# EAGLE design mftPlanetarium2-selfassemble (EAGLE 7.5.0)
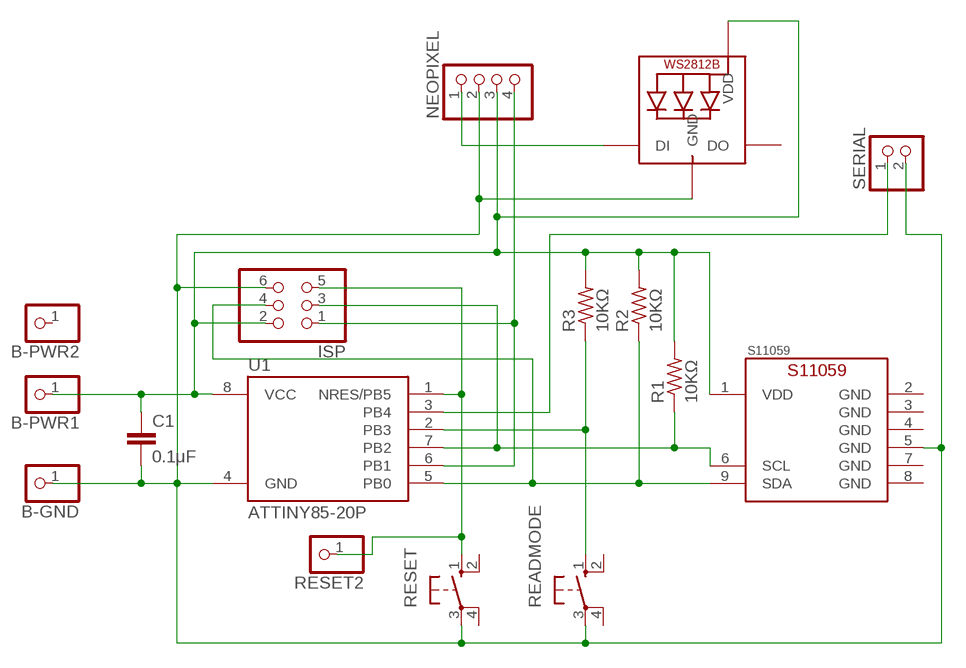
[diagram p0: schematic, sheet 1]

## Parts
B-GND  PINHD-1X1  [1X01]
B-PWR1  PINHD-1X1  [1X01]
B-PWR2  PINHD-1X1  [1X01]
C1  0.1μF  C-EU025-025X050  [C025-025X050]
ISP  PINHD-2X3  [2X03]
LED1  WS2812B5050  [WS2812B]
NEOPIXEL  PINHD-1X4  [1X04]
R1  10KΩ  R-US_0204/7  [0204/7]
R2  10KΩ  R-US_0204/7  [0204/7]
R3  10KΩ  R-US_0204/7  [0204/7]
READMODE  10-XX  [B3F-10XX]
RESET  10-XX  [B3F-10XX]
RESET2  PINHD-1X1  [1X01]
S11059  S11059  HAMAMATSU-S11059  [HAMAMATSU-S11059]
SERIAL  PINHD-1X2  [1X02]
U1  ATTINY85-20P  [PDIP08_300MIL]

## Nets
GND [Power]: B-GND.1 C1.2 ISP.6 LED1.3-GND(GND) NEOPIXEL.2 READMODE.3(P) RESET.3(P) S11059.5(GND) SERIAL.2 U1.4(GND)
N$1: LED1.4-DIN(DI) NEOPIXEL.1
N$3: ISP.1 NEOPIXEL.4 U1.6(PB1)
N$6: SERIAL.1 U1.3(PB4)
N$7 [Power]: ISP.5 RESET2.1 RESET.1(S) U1.1(NRES/PB5)
N$8: R3.1 READMODE.1(S) U1.2(PB3)
PWR [Power]: B-PWR1.1 C1.1 ISP.2 LED1.1-VDD(VDD) NEOPIXEL.3 R1.2 R2.2 R3.2 S11059.1(VDD) U1.8(VCC)
SCL: ISP.3 R1.1 S11059.6(SCL) U1.7(PB2)
SDA: ISP.4 R2.1 S11059.9(SDA) U1.5(PB0)
Unconnected: B-PWR2.1 LED1.2-DOUT(DO) READMODE.2(S1) READMODE.4(P1) RESET.2(S1) RESET.4(P1) S11059.2(GND) S11059.3(GND) S11059.4(GND) S11059.7(GND) S11059.8(GND)

## Library data of the parts
B-GND B-PWR1 B-PWR2 RESET2 = pinhead:PINHD-1X1: PIN HEADER
C1 = resistor:C-EU: CAPACITOR, European symbol
ISP = pinhead:PINHD-2X3: PIN HEADER
LED1 = adafruit:WS2812B
NEOPIXEL = pinhead:PINHD-1X4: PIN HEADER
R1-R3 = resistor:R-US_: RESISTOR, American symbol
READMODE RESET = switch-omron:10-XX: OMRON SWITCH; MPN: B3F-1000; OC_FARNELL: 176432; OC_NEWARK: 36M3542
S11059 = FaBo-Sensor:HAMAMATSU-S11059
SERIAL = pinhead:PINHD-1X2: PIN HEADER
U1 = _hhn_attiny25_45_85:ATTINY85*: ATMEL ATtiny 85 Packages: P = PDIP 08 30mil S = SOIC 08 EIAJ 208mil Technologies Note: for complete ordering code (temp. range, finish, tape&reel etc.) see www.atmel.com • Supply Voltage: V = (1.8…5.5)V | [blank] = (2.7…5.5)V • Speed: 10 = 10 MHz | 20 = 20 MHz Author: Dipl.-Ing. FH Rainer Bayer HHN Hochschule Heilbronn (Heilbronn University), rainer.bayer@hs-heilbronn.de Ingenieurbüro ing-rb, mail@ing-rb.de

## Net classes
0 default: width 0.305 mm, clearance 0.254 mm
1 Power: width 0.457 mm, clearance 0.254 mm

## Board
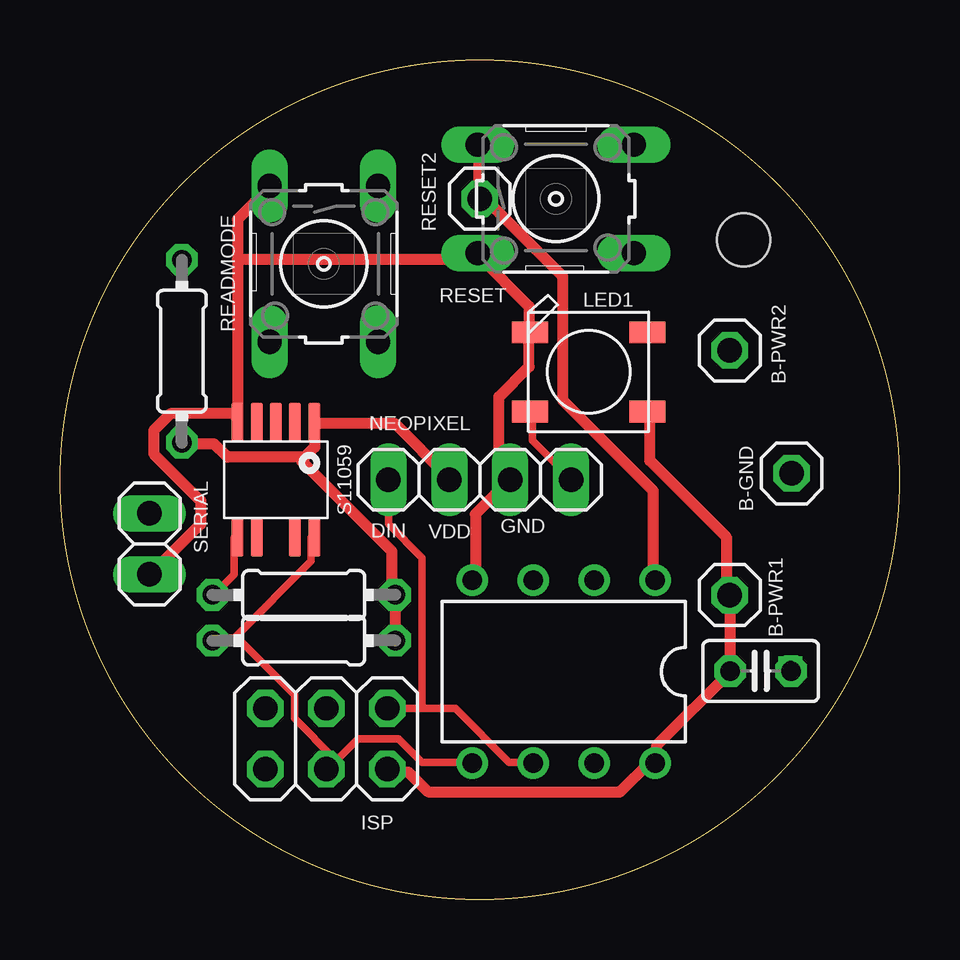
[diagram p1: board, top side]
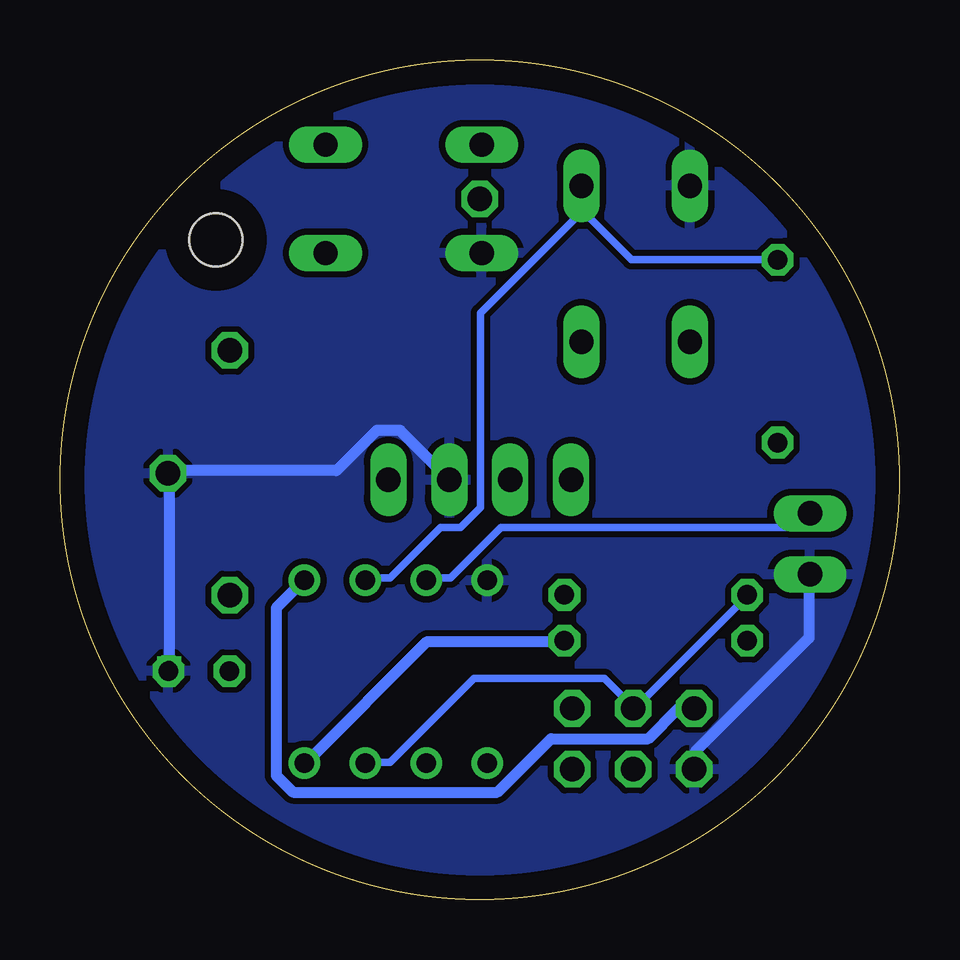
[diagram p2: board, bottom side, seen from below]

Size 35 x 35 mm. Coordinates in mm from the lower left corner, seen from the top.
Outline: circle at 17.5,17.5 radius 17.5
Copper layers (1*16): Top 0.035mm / dielectric 1.5mm / Bottom 0.035mm
Design rules "default": minimum track width 10mil, minimum drill 24mil, track to track 8mil, track to pad 8mil, pad to pad 8mil, via to via 8mil, smd to smd 8mil, copper to edge 40mil, drill to drill 8mil, minimum pad ring 10mil, minimum via ring 8mil, stop-mask expansion 4mil, vias tented up to drill 0mil, thermal gap 10mil
Holes 2.2 mm at 28.5,27.5

### Footprints (pad centres in the part's own frame; a part is rotated, then mirrored left to right if it is on the bottom)
1X01 = drill 1.016 octagon: 1 0,0
C025-025X050 = drill 0.813 octagon: 1 -1.27,0; 2 1.27,0
2X03 = drill 1.016 octagon: 1 -2.54,-1.27; 2 -2.54,1.27; 3 0,-1.27; 4 0,1.27; 5 2.54,-1.27; 6 2.54,1.27
WS2812B = smd 1.5 x 0.9: 1-VDD 2.45,-1.65; 2-DOUT 2.45,1.65; 3-GND -2.45,1.65; 4-DIN -2.45,-1.65
1X04 = drill 1.016 long: 1 -3.81,0; 2 -1.27,0; 3 1.27,0; 4 3.81,0
0204/7 = drill 0.813 octagon: 1 -3.81,0; 2 3.81,0
B3F-10XX = drill 1.016 long: 1 -3.251,2.261; 2 3.251,2.261; 3 -3.251,-2.261; 4 3.251,-2.261
HAMAMATSU-S11059 = smd 1.65 x 0.5: 1 -2.375,1.6; 2 -2.375,0.8; 3 -2.375,0; 4 -2.375,-0.8; 5 -2.375,-1.6; 6 2.375,-1.6; 7 2.375,-0.8; 8 2.375,0.8; 9 2.375,1.6
1X02 = drill 1.016 long: 1 -1.27,0; 2 1.27,0
PDIP08_300MIL = drill 0.813: 1 -3.81,-3.81; 2 -1.27,-3.81; 3 1.27,-3.81; 4 3.81,-3.81; 5 3.81,3.81; 6 1.27,3.81; 7 -1.27,3.81; 8 -3.81,3.81

### Placement (x,y rotation side)
B-GND  30.5,17.77 0 top
B-PWR1  27.92,12.69 0 top
B-PWR2  27.92,22.89 0 top
C1  29.21,9.53 0 top
ISP  11.1,6.7 180 top
LED1  22.04,22 0 top
NEOPIXEL  17.5,17.5 180 top
R1  10.16,12.7 0 top
R2  10.16,10.79 0 top
R3  5.08,22.86 270 top
READMODE  11,26.5 270 top
RESET  20.68,29.21 0 top
RESET2  17.5,29.21 0 top
S11059  9,17.5 270 top
SERIAL  3.73,14.83 270 top
U1  21,9.5 180 top

### Tracks (layer width: path | path; a pad name or v marks a point on that pad's centre or on a via)
GND  (via drill 0.6)
  Top 0.457: v8.52,5.45 ISP.6 | v3.77,13.55 SERIAL.2 3.91,13.69 5.87,15.65 5.87,16.62 3.91,18.58 3.91,19.56 4.61,20.26 7.26,20.26 S11059.5 7.4,19.98 7.4,26.68 | 7.4,26.68 7.4,28.36 8.66,29.62 READMODE.3 | v30.45,9.64 C1.2 | v30.45,17.74 B-GND.1 | U1.4 17.32,13.41 17.32,16.07 18.72,17.46 NEOPIXEL.2 18.58,17.6 18.3,17.88 18.3,20.95 19.56,22.21 19.56,23.47 LED1.3-GND 19.56,23.75 19.56,24.73 17.46,26.82 RESET.3 17.32,26.68 7.4,26.68
  Bottom 0.457: v8.52,5.45 8.52,6.15 3.77,10.9 v3.77,13.55 | v30.45,17.74 v30.45,9.64 | B-GND.1 30.45,17.88 23.47,17.88 21.79,19.56 20.82,19.56 18.86,17.6 NEOPIXEL.2
  pour Bottom: 0.5,17.5 arc90 17.5,0.5 arc90 34.5,17.5 arc90 17.5,34.5 arc90
N$1
  Top 0.305: LED1.4-DIN 19.7,20.26 19.7,19.14 21.23,17.6 NEOPIXEL.1
N$3
  Top 0.305: 15.09,7.96 13.69,7.96 ISP.1 | 15.09,7.96 16.48,7.96 18.72,5.73 19.7,5.73 U1.6 | 15.09,7.96 15.09,14.25 13.69,15.65 13.69,17.46 NEOPIXEL.4
N$6
  Bottom 0.305: U1.3 19.7,13.41 18.72,13.41 16.62,15.51 4.33,15.51 3.77,16.07 SERIAL.1
N$7
  Top 0.457: U1.1 24.73,13.41 24.73,17.04 20.95,20.82 20.95,25.98 17.6,29.34 RESET2.1 17.46,29.48 17.46,31.43 RESET.1
  Bottom 0.457: ISP.5 8.66,7.96 9.22,7.96 10.48,6.71 14.53,6.71 16.76,4.47 25.29,4.47 25.98,5.17 25.98,12.15 24.87,13.27 U1.1
N$8
  Bottom 0.305: U1.2 22.21,13.41 21.23,13.41 19.14,15.51 18.3,15.51 17.46,16.34 17.46,24.45 13.27,28.64 13.27,29.62 READMODE.1 13.13,28.64 11.18,26.68 5.17,26.68 R3.1
PWR
  Top 0.457: R2.2 R1.2 13.83,12.85 13.83,14.53 10.06,18.3 10.06,18.44 | NEOPIXEL.3 16.2,17.6 13.97,19.84 10.62,19.84 S11059.1 10.62,19.7 10.62,18.86 10.2,18.44 10.06,18.44 | 10.06,18.44 6.99,18.44 6.43,19 5.17,19 R3.2 | LED1.1-VDD 24.59,20.26 24.59,18.3 27.8,15.09 27.8,12.71 B-PWR1.1 27.94,12.57 C1.1 27.94,9.5 24.87,6.43 24.87,5.73 U1.8 24.59,5.73 23.33,4.47 15.37,4.47 14.53,5.31 13.69,5.31 ISP.2
  Bottom 0.457: R2.2 13.97,10.76 19.7,10.76 24.73,5.73 U1.8
SCL
  Top 0.305: S11059.6 7.26,15.09 7.26,13.55 6.43,12.71 R1.1
  Bottom 0.305: U1.7 22.21,5.73 21.23,5.73 17.74,9.22 12.29,9.22 11.18,8.1 ISP.3 11.04,7.96 6.43,12.57 R1.1
SDA
  Top 0.305: U1.5 17.18,5.73 15.09,5.73 14.11,6.71 12.43,6.71 11.18,5.45 ISP.4 11.46,5.87 9.78,7.54 9.78,8.52 7.33,10.97 | 7.33,10.97 7.26,10.9 6.43,10.9 R2.1 | 7.33,10.97 10.48,14.11 10.48,15.09 S11059.9

### Text on the board
tNames: DIN | VDD | GND